# Altium project STM32H750底板.PrjPcb
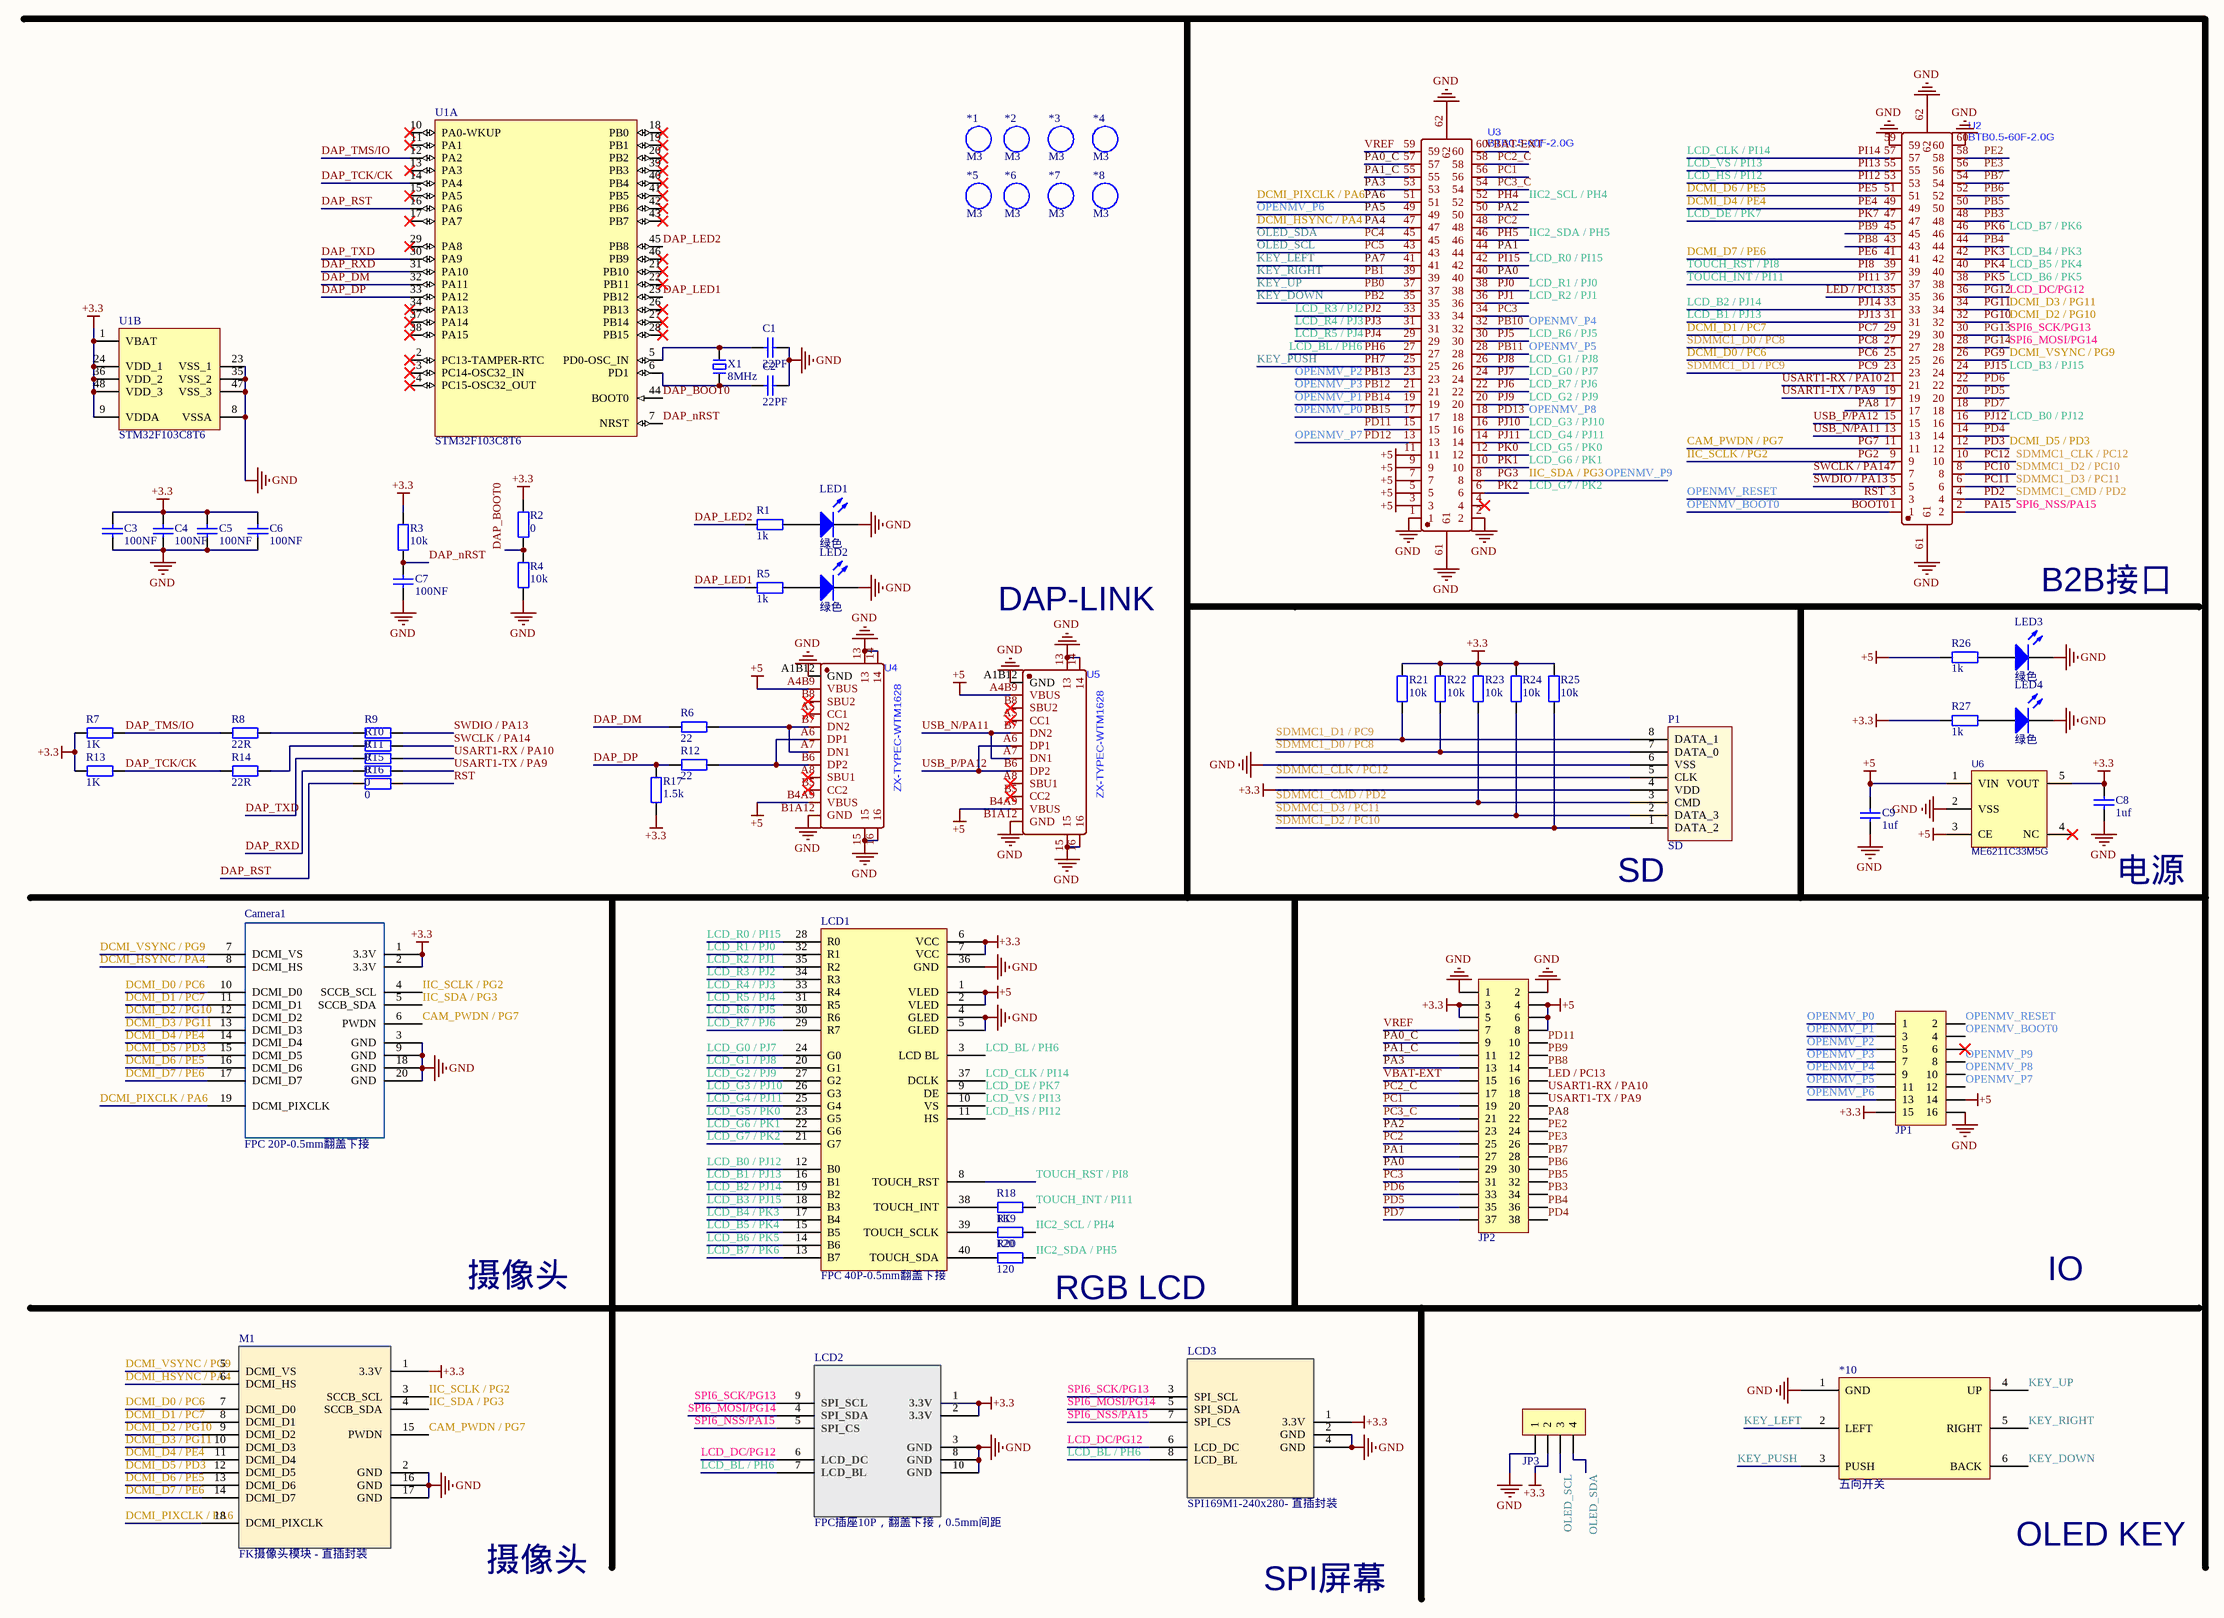
[diagram p0: Sheet1.SchDoc]
1 sheet, 65 parts. Net scope: global (net labels, ports and power ports of the same name join across sheets).
Board file: PCB1.PcbDoc

## Sheet Sheet1.SchDoc
size A2; SheetNumber: 1; SheetTotal: 1

### Parts
*1  M3  [M3 125X200]
*2  M3  [M3 125X200]
*3  M3  [M3 125X200]
*4  M3  [M3 125X200]
*5  M3  [M3 125X200]
*6  M3  [M3 125X200]
*7  M3  [M3 125X200]
*8  M3  [M3 125X200]
*10  五向开关  [PCBComponent_1 - duplicate]
C1  22PF  [C0603_L]
C2  22PF  [C0603_L]
C3  100NF  [C0603_L]
C4  100NF  [C0603_L]
C5  100NF  [C0603_L]
C6  100NF  [C0603_L]
C7  100NF  [C0603_L]
C8  1uf  [C0603_L]
C9  1uf  [C0603_L]
Camera1  FPC 20P-0.5mm翻盖下接  [FPC20P-0.5MM]
JP1  Header 8X2  [HDR2.54-LI-2x8P]  (value not drawn)
JP2  Header 2X11  [HDR2.54-LI-2x19P]  (value not drawn)
JP3  HDR-1X4  [HDR2.54-LI-4P]  (value not drawn)
LCD1  FPC 40P-0.5mm翻盖下接  [FPC40P-0.5MM]
LCD2  FPC插座10P，翻盖下接，0.5mm间距  [FPC10P-0.5MM]
LCD3  SPI169M1-240x280- 直插封装  [SPI169M1-240x280 - 直插封装]
LED1  绿色  [LED0805_G]
LED2  绿色  [LED0805_G]
LED3  绿色  [LED0805_G]
LED4  绿色  [LED0805_G]
M1  FK摄像头模块 - 直插封装
P1  SD  [MICRO SD]
R1  1k  [R0603_L]
R2  0  [R0603_L]
R3  10k  [R0603_L]
R4  10k  [R0603_L]
R5  1k  [R0603_L]
R6  22  [R0402_L]
R7  1K  [R0603_L]
R8  22R  [R0603_L]
R9  0  [R0603_L]
R10  0  [R0603_L]
R11  0  [R0603_L]
R12  22  [R0402_L]
R13  1K  [R0603_L]
R14  22R  [R0603_L]
R15  0  [R0603_L]
R16  0  [R0603_L]
R17  1.5k  [R0402_L]
R18  1K  [R0603_L]
R19  120  [R0603_L]
R20  120  [R0603_L]
R21  10k  [R0603_L]
R22  10k  [R0603_L]
R23  10k  [R0603_L]
R24  10k  [R0603_L]
R25  10k  [R0603_L]
R26  1k  [R0603_L]
R27  1k  [R0603_L]
U1  STM32F103C8T6  [LQFP48_N]  (parts A,B of 2)
U2  BTB0.5-60F-2.0G  [CONN-SMD_60P-P0.50_BTB0.5-60F-2.0G]
U3  BTB0.5-60F-2.0G  [CONN-SMD_60P-P0.50_BTB0.5-60F-2.0G]
U4  ZX-TYPEC-WTM1628  [USB-C-SMD_ZX-TYPEC-WTM1628]
U5  ZX-TYPEC-WTM1628  [USB-C-SMD_ZX-TYPEC-WTM1628]
U6  ME6211C33M5G  [SOT-23-5]
X1  8MHz  [XTAL-3215-2P]

### Nets
+3.3: C3.2 C4.2 C5.2 C6.2 C8.2 Camera1.1(3.3V) Camera1.2(3.3V) JP1.15 JP2.3 JP2.5 JP3.2 LCD1.6(VCC) LCD1.7(VCC) LCD2.1(3.3V) LCD2.2(3.3V) LCD3.1(3.3V) M1.1(3.3V) P1.4(VDD) R2.2 R3.2 R7.1 R13.1 R17.1 R21.1 R22.1 R23.1 R24.1 R25.1 R27.1 U1.1(VBAT) U1.9(VDDA) U1.24(VDD_1) U1.36(VDD_2) U1.48(VDD_3) U6.5(VOUT)
+5: C9.2 JP1.14 JP2.4 JP2.6 JP2.8 LCD1.1(VLED) LCD1.2(VLED) R26.1 U3.3 U3.5 U3.7 U3.9 U3.11 U4.A4B9(VBUS) U4.B4A9(VBUS) U5.A4B9(VBUS) U5.B4A9(VBUS) U6.1(VIN) U6.3(CE)
GND: *10.1(GND) C1.2 C2.2 C3.1 C4.1 C5.1 C6.1 C7.1 C8.1 C9.1 Camera1.3(GND) Camera1.9(GND) Camera1.18(GND) Camera1.20(GND) JP1.16 JP2.1 JP2.2 JP3.1 LCD1.4(GLED) LCD1.5(GLED) LCD1.36(GND) LCD2.3(GND) LCD2.8(GND) LCD2.10(GND) LCD3.2(GND) LCD3.4(GND) LED1.2(K) LED2.2(K) LED3.2(K) LED4.2(K) M1.2(GND) M1.16(GND) M1.17(GND) P1.6(VSS) R4.1 U1.8(VSSA) U1.23(VSS_1) U1.35(VSS_2) U1.47(VSS_3) U2.59 U2.60 U2.61 U2.62 U3.1 U3.2 U3.61 U3.62 U4.13 U4.14 U4.15 U4.16 U4.A1B12(GND) U4.B1A12(GND) U5.13 U5.14 U5.15 U5.16 U5.A1B12(GND) U5.B1A12(GND) U6.2(VSS)
BOOT0: JP1.4 U2.1  [also labelled OPENMV_BOOT0]
CAM_PWDN / PG7: Camera1.6(PWDN) M1.15(PWDN) U2.11  [also labelled PG7]
DAP_BOOT0: R2.1 R4.2 U1.44(BOOT0)
DAP_DM: R6.1 U1.32(PA11)
DAP_DP: R12.1 R17.2 U1.33(PA12)
DAP_LED1: R5.1 U1.25(PB12)
DAP_LED2: R1.1 U1.45(PB8)
DAP_nRST: C7.2 R3.1 U1.7(NRST)
DAP_RST: R16.1 U1.16(PA6)
DAP_RXD: R15.1 U1.31(PA10)
DAP_TCK/CK: R13.2 R14.1 U1.14(PA4)
DAP_TMS/IO: R7.2 R8.1 U1.12(PA2)
DAP_TXD: R11.1 U1.30(PA9)
DCMI_D0 / PC6: Camera1.10(DCMI_D0) M1.7(DCMI_D0) U2.25  [also labelled PC6]
DCMI_D1 / PC7: Camera1.11(DCMI_D1) M1.8(DCMI_D1) U2.29  [also labelled PC7]
DCMI_D2 / PG10: Camera1.12(DCMI_D2) M1.9(DCMI_D2) U2.32  [also labelled PG10]
DCMI_D3 / PG11: Camera1.13(DCMI_D3) M1.10(DCMI_D3) U2.34  [also labelled PG11]
DCMI_D4 / PE4: Camera1.14(DCMI_D4) M1.11(DCMI_D4) U2.49  [also labelled PE4]
DCMI_D5 / PD3: Camera1.15(DCMI_D5) M1.12(DCMI_D5) U2.12  [also labelled PD3]
DCMI_D6 / PE5: Camera1.16(DCMI_D6) M1.13(DCMI_D6) U2.51  [also labelled PE5]
DCMI_D7 / PE6: Camera1.17(DCMI_D7) M1.14(DCMI_D7) U2.41  [also labelled PE6]
DCMI_HSYNC / PA4: Camera1.8(DCMI_HS) M1.6(DCMI_HS) U3.47  [also labelled PA4]
DCMI_PIXCLK / PA6: Camera1.19(DCMI_PIXCLK) M1.18(DCMI_PIXCLK) U3.51  [also labelled PA6]
DCMI_VSYNC / PG9: Camera1.7(DCMI_VS) M1.5(DCMI_VS) U2.26  [also labelled PG9]
IIC2_SCL / PH4: R19.2 U3.52  [also labelled PH4]
IIC2_SDA / PH5: R20.2 U3.46  [also labelled PH5]
IIC_SCLK / PG2: Camera1.4(SCCB_SCL) M1.3(SCCB_SCL) U2.9  [also labelled PG2]
IIC_SDA / PG3: Camera1.5(SCCB_SDA) JP1.8 M1.4(SCCB_SDA) U3.8  [also labelled OPENMV_P9, PG3]
KEY_DOWN: *10.6(BACK) U3.35  [also labelled PB2]
KEY_LEFT: *10.2(LEFT) U3.41  [also labelled PA7]
KEY_PUSH: *10.3(PUSH) U3.25  [also labelled PH7]
KEY_RIGHT: *10.5(RIGHT) U3.39  [also labelled PB1]
KEY_UP: *10.4(UP) U3.37  [also labelled PB0]
LCD_B0 / PJ12: LCD1.12(B0) U2.16  [also labelled PJ12]
LCD_B1 / PJ13: LCD1.16(B1) U2.31  [also labelled PJ13]
LCD_B2 / PJ14: LCD1.19(B2) U2.33  [also labelled PJ14]
LCD_B3 / PJ15: LCD1.18(B3) U2.24  [also labelled PJ15]
LCD_B4 / PK3: LCD1.17(B4) U2.42  [also labelled PK3]
LCD_B5 / PK4: LCD1.15(B5) U2.40  [also labelled PK4]
LCD_B6 / PK5: LCD1.14(B6) U2.38  [also labelled PK5]
LCD_B7 / PK6: LCD1.13(B7) U2.46  [also labelled PK6]
LCD_BL / PH6: LCD1.3(LCD_BL) LCD2.7(LCD_BL) LCD3.8(LCD_BL) U3.27  [also labelled PH6]
LCD_CLK / PI14: LCD1.37(DCLK) U2.57  [also labelled PI14]
LCD_DC/PG12: LCD2.6(LCD_DC) LCD3.6(LCD_DC) U2.36  [also labelled PG12]
LCD_DE / PK7: LCD1.9(DE) U2.47  [also labelled PK7]
LCD_G0 / PJ7: LCD1.24(G0) U3.24  [also labelled PJ7]
LCD_G1 / PJ8: LCD1.20(G1) U3.26  [also labelled PJ8]
LCD_G2 / PJ9: LCD1.27(G2) U3.20  [also labelled PJ9]
LCD_G3 / PJ10: LCD1.26(G3) U3.16  [also labelled PJ10]
LCD_G4 / PJ11: LCD1.25(G4) U3.14  [also labelled PJ11]
LCD_G5 / PK0: LCD1.23(G5) U3.12  [also labelled PK0]
LCD_G6 / PK1: LCD1.22(G6) U3.10  [also labelled PK1]
LCD_G7 / PK2: LCD1.21(G7) U3.6  [also labelled PK2]
LCD_HS / PI12: LCD1.11(HS) U2.53  [also labelled PI12]
LCD_R0 / PI15: LCD1.28(R0) U3.42  [also labelled PI15]
LCD_R1 / PJ0: LCD1.32(R1) U3.38  [also labelled PJ0]
LCD_R2 / PJ1: LCD1.35(R2) U3.36  [also labelled PJ1]
LCD_R3 / PJ2: LCD1.34(R3) U3.33  [also labelled PJ2]
LCD_R4 / PJ3: LCD1.33(R4) U3.31  [also labelled PJ3]
LCD_R5 / PJ4: LCD1.31(R5) U3.29  [also labelled PJ4]
LCD_R6 / PJ5: LCD1.30(R6) U3.30  [also labelled PJ5]
LCD_R7 / PJ6: LCD1.29(R7) U3.22  [also labelled PJ6]
LCD_VS / PI13: LCD1.10(VS) U2.55  [also labelled PI13]
LED / PC13: JP2.16 U2.35
OLED_SCL: JP3.3 U3.43  [also labelled PC5]
OLED_SDA: JP3.4 U3.45  [also labelled PC4]
OPENMV_P0: JP1.1 U3.17  [also labelled PB15]
OPENMV_P1: JP1.3 U3.19  [also labelled PB14]
OPENMV_P2: JP1.5 U3.23  [also labelled PB13]
OPENMV_P3: JP1.7 U3.21  [also labelled PB12]
OPENMV_P4: JP1.9 U3.32  [also labelled PB10]
OPENMV_P5: JP1.11 U3.28  [also labelled PB11]
OPENMV_P6: JP1.13 U3.49  [also labelled PA5]
OPENMV_P7: JP1.12 U3.13  [also labelled PD12]
OPENMV_P8: JP1.10 U3.18  [also labelled PD13]
OPENMV_RESET: JP1.2 R16.2 U2.3  [also labelled RST]
PA0: JP2.29 U3.40
PA0_C: JP2.9 U3.57
PA1: JP2.27 U3.44
PA1_C: JP2.11 U3.55
PA2: JP2.23 U3.50
PA3: JP2.13 U3.53
PA8: JP2.22 U2.17
PA15: LCD2.5(SPI_CS) LCD3.7(SPI_CS) U2.2  [also labelled SPI6_NSS/PA15]
PB3: JP2.34 U2.48
PB4: JP2.36 U2.44
PB5: JP2.32 U2.50
PB6: JP2.30 U2.52
PB7: JP2.28 U2.54
PB8: JP2.14 U2.43
PB9: JP2.12 U2.45
PC1: JP2.19 U3.56
PC2: JP2.25 U3.48
PC2_C: JP2.17 U3.58
PC3: JP2.31 U3.34
PC3_C: JP2.21 U3.54
PC8: P1.7(DATA_0) R22.2 U2.27  [also labelled SDMMC1_D0 / PC8]
PC9: P1.8(DATA_1) R21.2 U2.23  [also labelled SDMMC1_D1 / PC9]
PC10: P1.1(DATA_2) R25.2 U2.8  [also labelled SDMMC1_D2 / PC10]
PC11: P1.2(DATA_3) R24.2 U2.6  [also labelled SDMMC1_D3 / PC11]
PC12: P1.5(CLK) U2.10  [also labelled SDMMC1_CLK / PC12]
PD2: P1.3(CMD) R23.2 U2.4  [also labelled SDMMC1_CMD / PD2]
PD4: JP2.38 U2.14
PD5: JP2.35 U2.20
PD6: JP2.33 U2.22
PD7: JP2.37 U2.18
PD11: JP2.10 U3.15
PE2: JP2.24 U2.58
PE3: JP2.26 U2.56
PG13: LCD2.9(SPI_SCL) LCD3.3(SPI_SCL) U2.30  [also labelled SPI6_SCK/PG13]
PG14: LCD2.4(SPI_SDA) LCD3.5(SPI_SDA) U2.28  [also labelled SPI6_MOSI/PG14]
PI8: LCD1.8(TOUCH_RST) U2.39  [also labelled TOUCH_RST / PI8]
PI11: R18.2 U2.37  [also labelled TOUCH_INT / PI11]
SWCLK / PA14: R10.2 U2.7
SWDIO / PA13: R9.2 U2.5
USART1-RX / PA10: JP2.18 R11.2 U2.21
USART1-TX / PA9: JP2.20 R15.2 U2.19
USB_N/PA11: U2.13 U5.A7(DN1) U5.B7(DN2)
USB_P/PA12: U2.15 U5.A6(DP1) U5.B6(DP2)
VBAT-EXT: JP2.15 U3.60
VREF: JP2.7 U3.59
NetC1_1: C1.1 U1.5(PD0-OSC_IN) X1.1
NetC2_1: C2.1 U1.6(PD1) X1.2
NetLCD1_38: LCD1.38(TOUCH_INT) R18.1
NetLCD1_39: LCD1.39(TOUCH_SCLK) R19.1
NetLCD1_40: LCD1.40(TOUCH_SDA) R20.1
NetLED1_1: LED1.1(A) R1.2
NetLED2_1: LED2.1(A) R5.2
NetLED3_1: LED3.1(A) R26.2
NetLED4_1: LED4.1(A) R27.2
NetR6_2: R6.2 U4.A7(DN1) U4.B7(DN2)
NetR8_2: R8.2 R9.1
NetR10_1: R10.1 R14.2
NetR12_2: R12.2 U4.A6(DP1) U4.B6(DP2)

Not connected (* = marked no-connect by the designer): JP1 6*; U1 2(PC13-TAMPER-RTC)* 3(PC14-OSC32_IN)* 4(PC15-OSC32_OUT)* 10(PA0-WKUP)* 11(PA1)* 13(PA3)* 15(PA5)* 17(PA7)* 18(PB0)* 19(PB1)* 20(PB2)* 21(PB10)* 22(PB11)* 26(PB13)* 27(PB14)* 28(PB15)* 29(PA8)* 34(PA13)* 37(PA14)* 38(PA15)* 39(PB3)* 40(PB4)* 41(PB5)* 42(PB6)* 43(PB7)* 46(PB9)*; U3 4*; U4 A5(CC1)* A8(SBU1)* B5(CC2)* B8(SBU2)*; U5 A5(CC1)* A8(SBU1)* B5(CC2)* B8(SBU2)*; U6 4(NC)*

### Notes on the sheet
- DAP-LINK
- B2B接口
- (near P1) SD
- 电源
- 摄像头
- RGB LCD
- IO
- OLED KEY
- SPI屏幕

### Library data of the parts
*1-*8 = M3: 铜柱孔
C1-C9 = C: 贴片电容/MLCC电容
Camera1 = FK_Camera
JP1 = Header 8X2: 8*2P接插件
JP2 = Header 19X2: 19*2P接插件
JP3 = Header 4: 4P接插件
LCD1 = MY-RGB
LCD2 = LCD-SPI
LED1-LED4 = LED: 贴片LED
P1 = Micro SD_SD: 自弹式TF卡座
R1-R27 = R: 贴片电阻
U1 = STM32F103C8T6: STM32 ARM-based 32-bit MCU Performance Line with 64 kB Flash, 20 kB Internal RAM, -40 to +85癈 Temperature, 48-Pin LQFP, Tray
U6 = ME6211C33: LDO 3.3V/0.5A
X1 = XTAL-2P: 2脚无源晶振(谐振器）